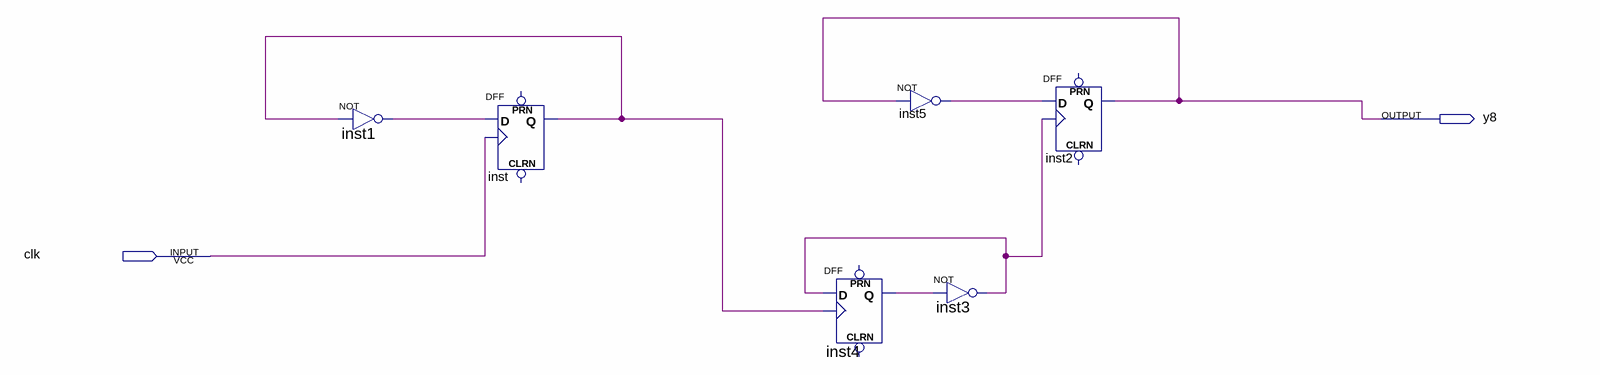
[diagram p0: schematic sheet]
// Quartus schematic 8Xdec.bdf as structural Verilog: 6 symbols, 2 pins
module \8Xdec  (
  input  clk,
  output y8
);

  wire inst1_out, inst3_out, inst4_q, inst5_out, inst_q;

  not inst1 (inst1_out, inst_q);
  DFF inst (.CLK(clk), .D(inst1_out), .Q(inst_q));  // open: CLRN, PRN
  DFF inst4 (.CLK(inst_q), .D(inst3_out), .Q(inst4_q));  // open: CLRN, PRN
  not inst5 (inst5_out, y8);
  not inst3 (inst3_out, inst4_q);
  DFF inst2 (.CLK(inst3_out), .D(inst5_out), .Q(y8));  // open: CLRN, PRN
endmodule
